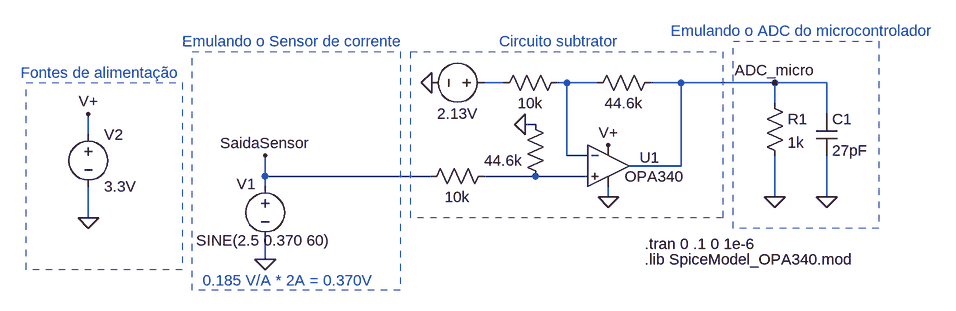
[diagram p0: schematic EL27-A15-Sensor_Corrente_LTspice.asc]
EL27-A15-Sensor_Corrente_LTspice.asc, the LTspice schematic file:
Version 4
SHEET 1 1924 12868
WIRE 304 32 272 32
WIRE 400 32 384 32
WIRE 448 32 400 32
WIRE 576 32 528 32
WIRE 720 32 576 32
WIRE 800 32 720 32
WIRE 720 64 720 32
WIRE 800 80 800 32
WIRE 352 96 336 96
WIRE -336 112 -336 80
WIRE 400 144 400 32
WIRE 432 144 400 144
WIRE 576 160 576 32
WIRE 576 160 496 160
WIRE -64 176 -64 144
WIRE 192 176 -64 176
WIRE 352 176 272 176
WIRE 432 176 352 176
WIRE -64 192 -64 176
WIRE 464 208 464 192
WIRE 720 208 720 144
WIRE 800 208 800 144
WIRE -336 240 -336 192
WIRE -64 304 -64 272
FLAG -64 304 0
FLAG -64 144 SaidaSensor
FLAG 720 208 0
FLAG 720 32 ADC_micro
FLAG -336 240 0
FLAG -336 80 V+
FLAG 800 208 0
FLAG 336 96 0
FLAG 192 32 0
FLAG 464 128 V+
FLAG 464 208 0
SYMBOL voltage -64 176 R0
WINDOW 123 0 0 Left 0
WINDOW 39 0 0 Left 0
WINDOW 0 -44 12 Left 2
WINDOW 3 -106 99 Left 2
SYMATTR InstName V1
SYMATTR Value SINE(2.5 0.370 60)
SYMBOL res 704 48 R0
SYMATTR InstName R1
SYMATTR Value 1k
SYMBOL voltage -336 96 R0
WINDOW 123 0 0 Left 0
WINDOW 39 0 0 Left 0
SYMATTR InstName V2
SYMATTR Value 3.3V
SYMBOL cap 784 80 R0
SYMATTR InstName C1
SYMATTR Value 27pF
SYMBOL Opamps\\opamp2 464 96 R0
WINDOW 0 48 51 Left 2
WINDOW 3 25 80 Left 2
SYMATTR InstName U1
SYMATTR Value OPA340
SYMBOL res 368 192 R180
WINDOW 0 36 76 Invisible 2
WINDOW 3 36 40 Left 2
SYMATTR InstName R2
SYMATTR Value 44.6k
SYMBOL res 176 192 R270
WINDOW 0 32 56 Invisible 2
WINDOW 3 0 56 VBottom 2
SYMATTR InstName R3
SYMATTR Value 10k
SYMBOL res 432 48 R270
WINDOW 0 32 56 Invisible 2
WINDOW 3 0 56 VBottom 2
SYMATTR InstName R4
SYMATTR Value 44.6k
SYMBOL res 288 48 R270
WINDOW 0 32 56 Invisible 2
WINDOW 3 0 56 VBottom 2
SYMATTR InstName R5
SYMATTR Value 10k
SYMBOL voltage 288 32 R90
WINDOW 0 -32 56 Invisible 2
WINDOW 3 32 56 VTop 2
WINDOW 123 0 0 Left 0
WINDOW 39 0 0 Left 0
SYMATTR InstName V5
SYMATTR Value 2.13V
TEXT 520 280 Left 2 !.tran 0 .1 0 1e-6
TEXT -160 336 Left 2 ;0.185 V/A * 2A = 0.370V
TEXT -192 -32 Left 2 ;Emulando o Sensor de corrente
TEXT 560 -48 Left 2 ;Emulando o ADC do microcontrolador
TEXT 296 -32 Left 2 ;Circuito subtrator
TEXT -440 16 Left 2 ;Fontes de alimentação
TEXT 520 304 Left 2 !.lib SpiceModel_OPA340.mod
RECTANGLE Normal 880 256 656 -32 2
RECTANGLE Normal -192 320 -432 32 2
RECTANGLE Normal -176 -16 144 352 2
RECTANGLE Normal 160 -16 640 240 2

The netlist it stands for:
* EL27-A15-Sensor_Corrente_LTspice.asc
V1 SaidaSensor 0 SINE(2.5 0.370 60)
R1 ADC_micro 0 1k
V2 V+ 0 3.3V
C1 ADC_micro 0 27pF
XU1 N003 N002 V+ 0 ADC_micro OPA340  ; pins In+ In- V+ V- OUT
R2 N003 0 44.6k
R3 SaidaSensor N003 10k
R4 N002 ADC_micro 44.6k
R5 N001 N002 10k
V5 N001 0 2.13V
.tran 0 .1 0 1e-6
* 0.185 V/A * 2A = 0.370V
* Emulando o Sensor de corrente
* Emulando o ADC do microcontrolador
* Circuito subtrator
* Fontes de alimentação
.lib SpiceModel_OPA340.mod
.backanno
.end